# EAGLE design DoorALIM (EAGLE 7.6.0)
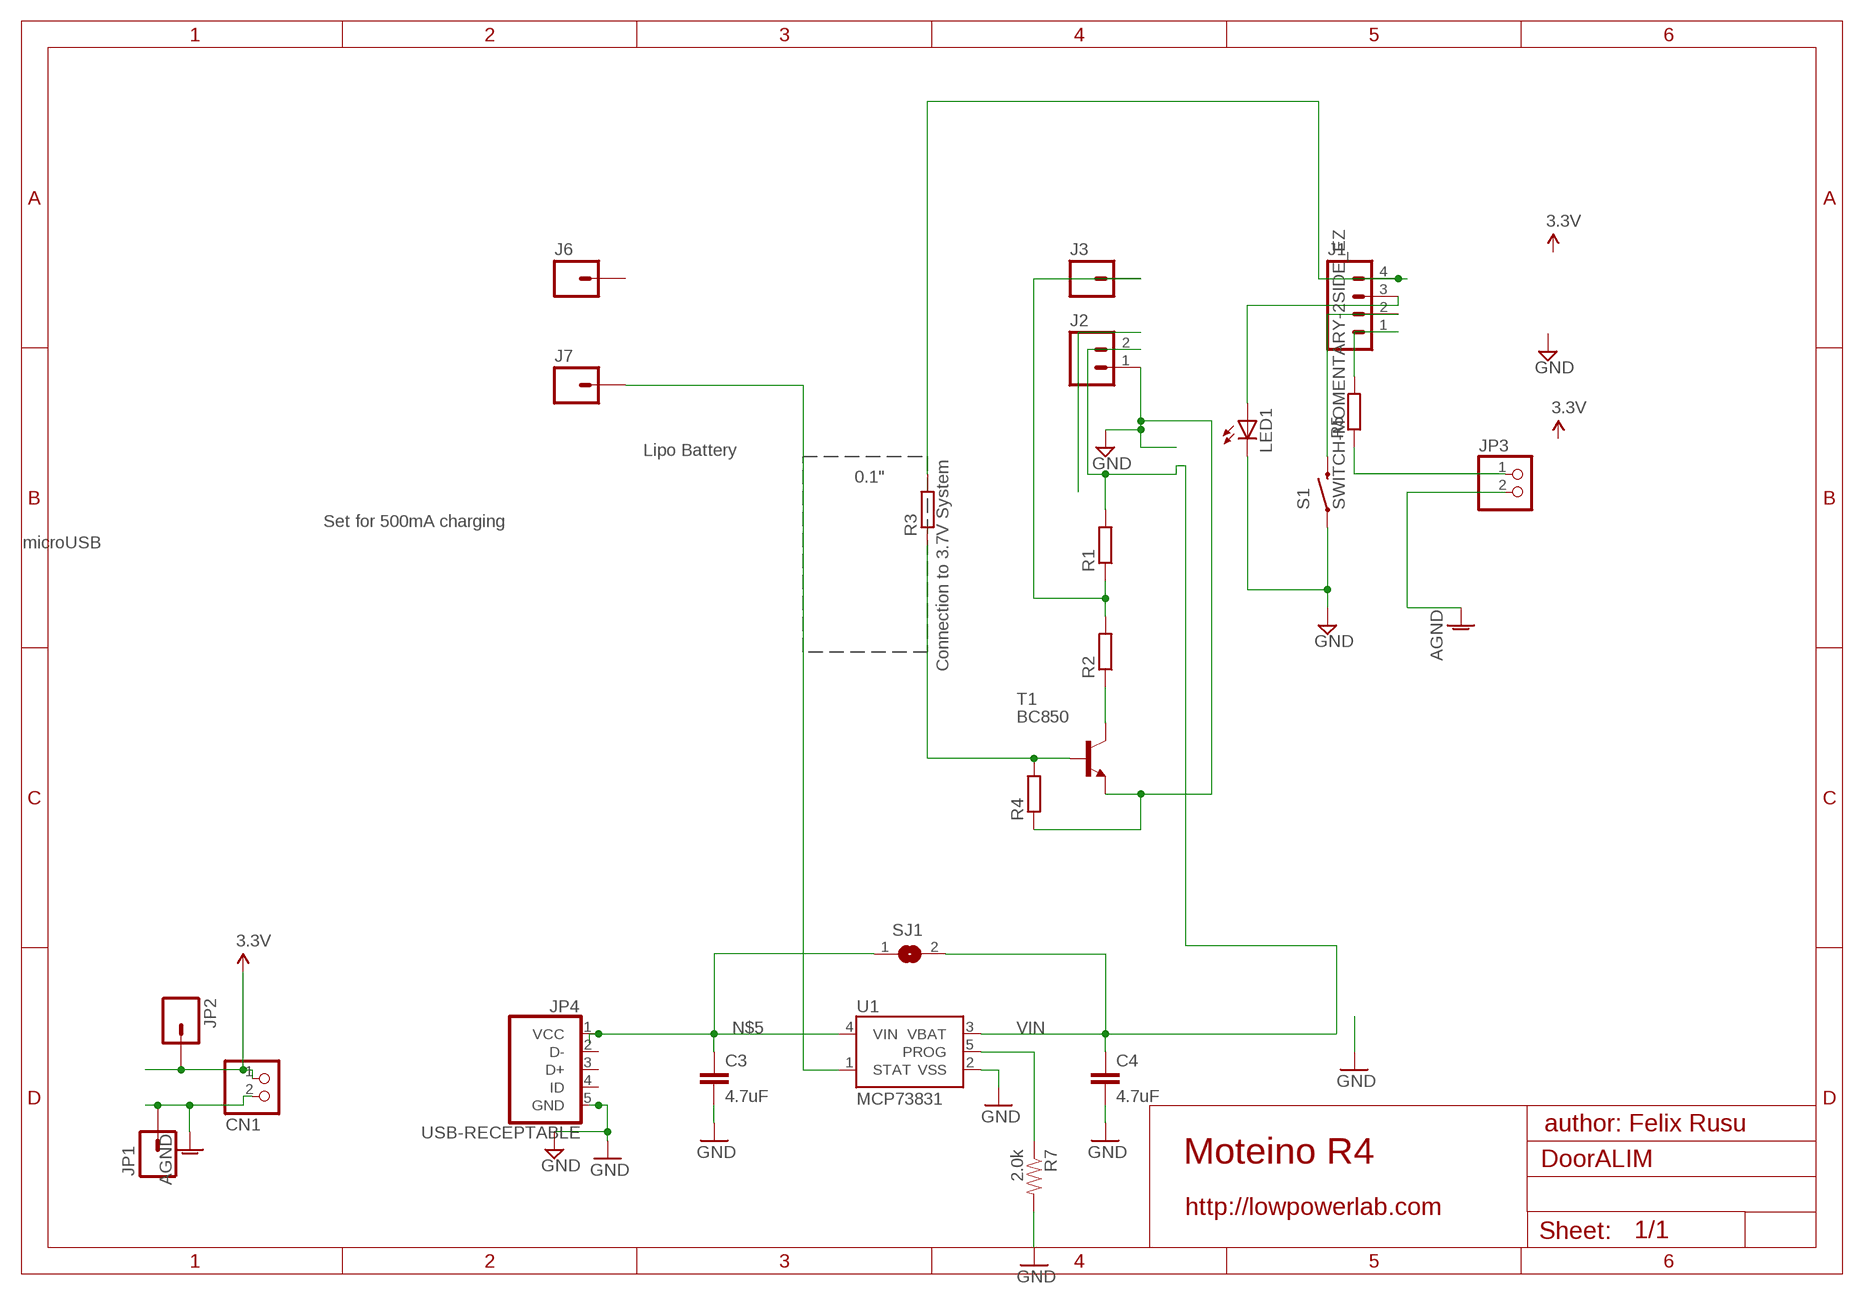
[diagram p0: schematic, sheet 1]

## Parts
C3  4.7uF  4.7UF-6.3V-10%(0603)0603  [0603-CAP]
C4  4.7uF  4.7UF-6.3V-10%(0603)0603  [0603-CAP]
CN1  JST_2PIN-SMT  [JST-PH-2-SMT]
J1  M04PTH  [1X04]
J2  M02PTH  [1X02]
J3  M01PTH  [1X01]
J6  M01PTH  [1X01]
J7  M01PTH  [1X01]
JP1  M01PTH  [1X01]
JP2  M01PTH  [1X01]
JP3  PINHD-1X2  [1X02]
JP4  USB-RECEPTABLE  [FCI-10103594-0001LF]
LED1  LED3MM  [LED3MM]
R1  R-EU_0204/7  [0204/7]
R2  R-EU_0204/7  [0204/7]
R3  R-EU_M1206  [M1206]
R4  R-EU_M1206  [M1206]
R5  R-EU_0204/7  [0204/7]
R7  2.0k  2.0KOHM1/10W5%(0603)  [0603-RES]
S1  SWITCH-MOMENTARY-2SIDE_EZ  [TACTILE-PTH-SIDEEZ]
SJ1  SJ  [SJ]
T1  BC850  [SOT23]
U1  MCP73831  [SOT23-5]

## Nets
AGND [power]: CN1.2 JP1.1 JP3.2
GND [power]: C3.2 C4.2 J2.1 JP4.5(GND) LED1.K(C) R4.1 R7.2 S1.1 T1.2(E) U1.2(VSS)
N$1: J1.2 S1.2
N$2: JP3.1 R5.1
N$3: J1.3 LED1.A
N$5: C3.1 JP4.1(VCC) SJ1.1 U1.4(VIN)
N$6: J3.1 R1.1 R2.2
N$7: R2.1 T1.3(C)
N$8: R3.1 R4.2 T1.1(B)
N$9: J1.4 R3.2
N$10: J1.1 R5.2
N$11: J7.1 U1.1(STAT)
PROG: R7.1 U1.5(PROG)
VCC: CN1.1 JP2.1 ; supply symbol labelled 3.3V
VIN: C4.1 J2.2 R1.2 SJ1.2 U1.3(VBAT)
Unconnected: J6.1 JP4.2(D-) JP4.3(D+) JP4.4(ID)

## Notes on the sheet
- Lipo Battery
- 0.1"
- Set for 500mA charging
- microUSB
- Connection to 3.7V System
- author: Felix Rusu
- Moteino R4
- http://lowpowerlab.com

## Library data of the parts
C3 C4 = SparkFun-Capacitors:4.7UF-6.3V-10%(0603): CAP-08280; PROD_ID: CAP-08280
CN1 = adafruit:JST_2PIN: JST 2-Pin Connectors of various flavors SMT-RA (S2B-PH-SM4) 4UConnector #17311 SMT (B2B-PH-SM4) THM-RA (S2B-PH) THM (B2B-PH)
J1 = SparkFun-Connectors:M04: Header 4 Standard 4-pin 0.1" header. Use with straight break away headers (SKU : PRT-00116), right angle break away headers (PRT-00553), swiss pins (PRT-00743), machine pins (PRT-00117), and female headers (PRT-00115). Molex polarized connector foot print use with SKU : PRT-08231 with associated crimp pins and housings. 1MM SMD Version SKU: PRT-10208; PROD_ID: CONN-09696
J2 = SparkFun-Connectors:M02: Standard 2-pin 0.1" header. Use with - straight break away headers ( PRT-00116) - right angle break away headers (PRT-00553) - swiss pins (PRT-00743) - machine pins (PRT-00117) - female headers (PRT-00115) Molex polarized connector foot print use with: PRT-08233 with associated crimp pins and housings. 2.54_SCREWTERM for use with PRT-10571. 3.5mm Screw Terminal footprints for PRT-08084 5mm Screw Terminal footprints for use with PRT-08432
J3 J6 J7 JP1 JP2 = SparkFun-Connectors:M01: Header 1 Standard 1-pin 0.1" header. Use with straight break away headers (SKU : PRT-00116), right angle break away headers (PRT-00553), swiss pins (PRT-00743), machine pins (PRT-00117), and female headers (PRT-00115). SMTSO-256-ET is a "flush mount" nut for a 4-40 screw. The older package used to be too tight, and did not allow it to sit properly thru the drill hit. The latest (0.165DIA) fits nice and snug.
JP3 = pinhead:PINHD-1X2: PIN HEADER
JP4 = daspilker:USB-RECEPTABLE: USB Receptable
LED1 = led:LED: LED OSRAM: - CHIPLED LG R971, LG N971, LY N971, LG Q971, LY Q971, LO R971, LY R971 LH N974, LH R974 LS Q976, LO Q976, LY Q976 LO Q996 - Hyper CHIPLED LW Q18S LB Q993, LB Q99A, LB R99A - SideLED LS A670, LO A670, LY A670, LG A670, LP A670 LB A673, LV A673, LT A673, LW A673 LH A674 LY A675 LS A676, LA A676, LO A676, LY A676, LW A676 LS A679, LY A679, LG A679 - Hyper Micro SIDELED® LS Y876, LA Y876, LO Y876, LY Y876 LT Y87S - SmartLED LW L88C, LW L88S LB L89C, LB L89S, LG L890 LS L89K, LO L89K, LY L89K LS L896, LA L896, LO L896, LY L896 - TOPLED LS T670, LO T670, LY T670, LG T670, LP T670 LSG T670, LSP T670, LSY T670, LOP T670, LYG T670 LG T671, LOG T671, LSG T671 LB T673, LV T673, LT T673, LW T673 LH T674 LS T676, LA T676, LO T676, LY T676, LB T676, LH T676, LSB T676, LW T676 LB T67C, LV T67C, LT T67C, LS T67K, LO T67K, LY T67K, LW E67C LS E67B, LA E67B, LO E67B, LY E67B, LB E67C, LV E67C, LT E67C LW T67C LS T679, LY T679, LG T679 LS T770, LO T770, LY T770, LG T770, LP T770 LB T773, LV T773, LT T773, LW T773 LH T774 LS E675, LA E675, LY E675, LS T675 LS T776, LA T776, LO T776, LY T776, LB T776 LHGB T686 LT T68C, LB T68C - Hyper Mini TOPLED® LB M676 - Mini TOPLED Santana® LG M470 LS M47K, LO M47K, LY M47K Source: http://www.osram.convergy.de LUXEON: - LUMILED® LXK2-PW12-R00, LXK2-PW12-S00, LXK2-PW14-U00, LXK2-PW14-V00 LXK2-PM12-R00, LXK2-PM12-S00, LXK2-PM14-U00 LXK2-PE12-Q00, LXK2-PE12-R00, LXK2-PE12-S00, LXK2-PE14-T00, LXK2-PE14-U00 LXK2-PB12-K00, LXK2-PB12-L00, LXK2-PB12-M00, LXK2-PB14-N00, LXK2-PB14-P00, LXK2-PB14-Q00 LXK2-PR12-L00, LXK2-PR12-M00, LXK2-PR14-Q00, LXK2-PR14-R00 LXK2-PD12-Q00, LXK2-PD12-R00, LXK2-PD12-S00 LXK2-PH12-R00, LXK2-PH12-S00 LXK2-PL12-P00, LXK2-PL12-Q00, LXK2-PL12-R00 Source: www.luxeon.com KINGBRIGHT: KA-3528ASYC Source: www.kingbright.com
R1-R5 = rcl:R-EU_: RESISTOR, European symbol
R7 = SparkFun-Resistors:2.0KOHM1/10W5%(0603): RES-08296; PROD_ID: RES-08296
S1 = SparkFun-Electromechanical:SWITCH-MOMENTARY-2: Various NO switches- pushbuttons, reed, etc
SJ1 = jumper:SJ: SMD solder JUMPER
T1 = transistor:BC850: NPN TRANSISTOR
U1 = SparkFun-PowerIC:MCP73831: Miniature single cell, fully integrated Li-Ion, Li-polymer charge management controller http://ww1.microchip.com/downloads/en/DeviceDoc/21984a.pdf IC-09995; PROD_ID: IC-09995

## Net classes
1 power: width 0.381 mm, clearance 0.254 mm

## Board
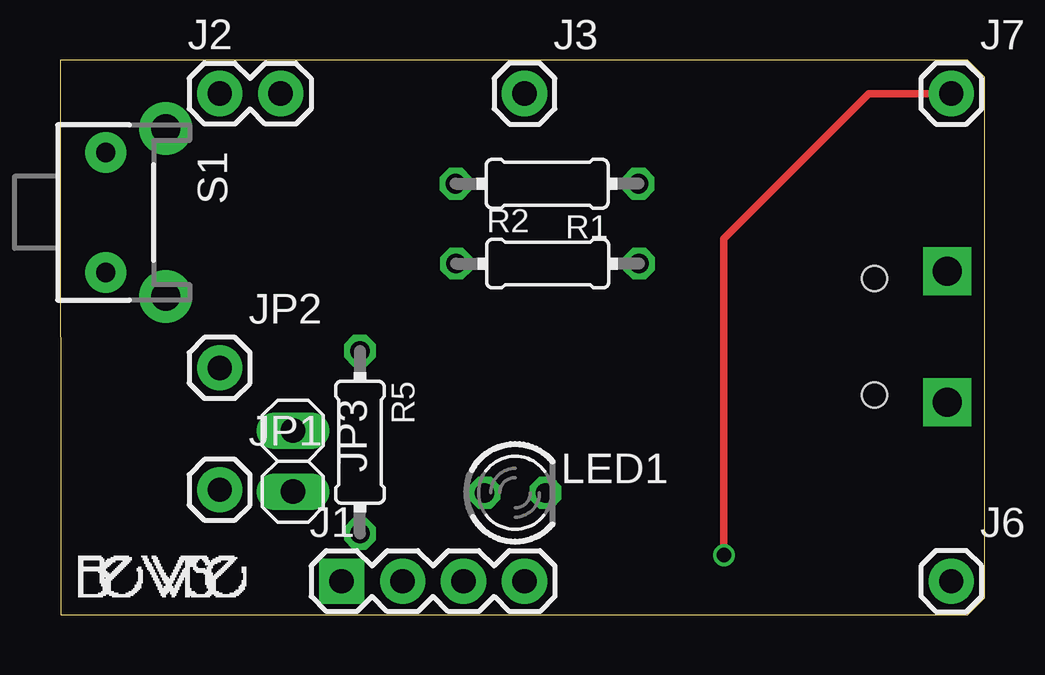
[diagram p1: board, top side]
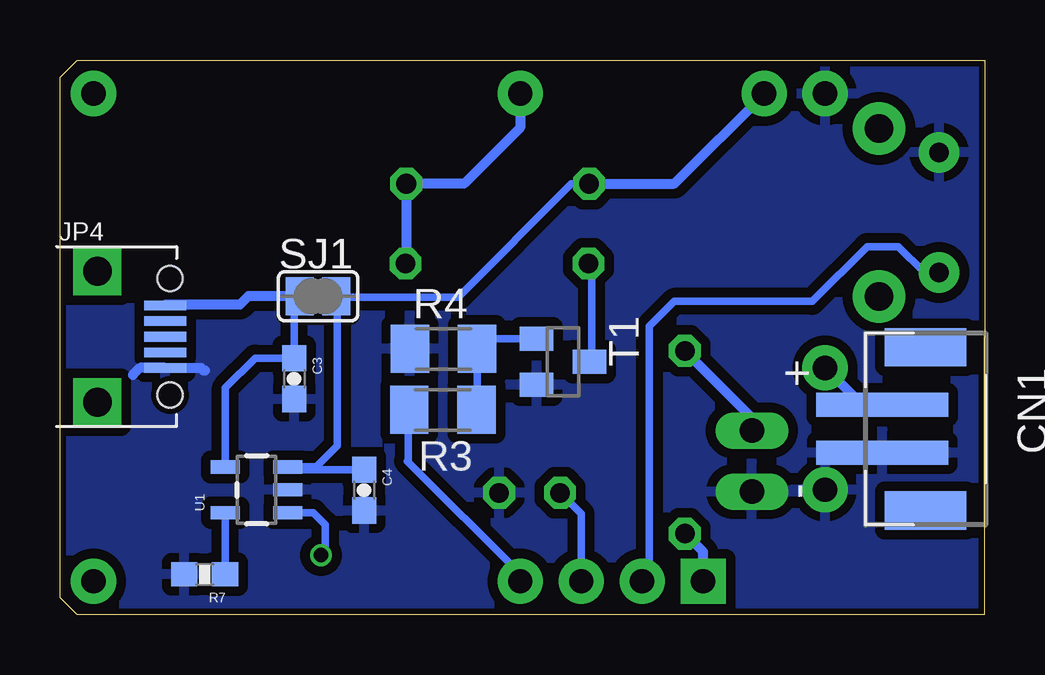
[diagram p2: board, bottom side, seen from below]

Size 38.53 x 23.11 mm. Coordinates in mm from the lower left corner, seen from the top.
Outline: 0.03,0 37.82,0 38.53,0.71 38.53,22.4 37.82,23.11 0,23.11 0.03,0
Copper layers (1*16): Top 0.035mm / dielectric 1.5mm / Bottom 0.035mm
Design rules "ITEADstudio_DRC *": minimum track width 6mil, minimum drill 12mil, track to track 16mil, track to pad 12mil, pad to pad 6mil, via to via 6mil, smd to smd 0mil, copper to edge 10mil, drill to drill 10mil, minimum pad ring 10mil, minimum via ring 6mil, stop-mask expansion 2mil, vias tented up to drill 100mil, thermal gap 15mil

### Footprints (pad centres in the part's own frame; a part is rotated, then mirrored left to right if it is on the bottom)
0603-CAP = smd 1.1 x 1: 1 -0.85,0; 2 0.85,0
JST-PH-2-SMT = smd 1 x 5.5: 1 -1,-1.8; 2 1,-1.8 | smd 1.6 x 3.4: NC1 -3.4,0; NC2 3.4,0
1X04 = drill 1.016 pad 1.88 square: 1 0,0 | drill 1.016 pad 1.88: 2 2.54,0; 3 5.08,0; 4 7.62,0
1X02 = drill 1.016 pad 1.88: 1 0,0; 2 2.54,0
1X01 = drill 1.016 pad 1.88: 1 0,0
1X02' = drill 1.016 long: 1 -1.27,0; 2 1.27,0
FCI-10103594-0001LF = smd 0.4 x 1.75: 1 -1.3,4.525; 2 -0.65,4.525; 3 0,4.525; 4 0.65,4.525; 5 1.3,4.525 | drill 1.2 pad 2 square: P$3 -2.725,1.7; P$4 2.725,1.7 | hole 1.05: -2.425,4.73; 2.425,4.73
LED3MM = drill 0.813 octagon: A -1.27,0; K 1.27,0
0204/7 = drill 0.813 octagon: 1 -3.81,0; 2 3.81,0
M1206 = smd 1.6 x 2: 1 -1.4,0; 2 1.4,0
0603-RES = smd 1.1 x 1: 1 -0.85,0; 2 0.85,0
TACTILE-PTH-SIDEEZ = drill 0.8 pad 1.7: 1 -2.5,0; 2 2.5,0 | drill 1.2 pad 2.2: ANCHOR1 -3.5,2.5; ANCHOR2 3.5,2.5
SJ = smd 1.168 x 1.6: 1 -0.762,0; 2 0.762,0
SOT23 = smd 1 x 1.4: 1 -0.95,-1.1; 2 0.95,-1.1; 3 0,1.1
SOT23-5 = smd 0.55 x 1.2: 1 -0.95,-1.3; 2 0,-1.3; 3 0.95,-1.3; 4 0.95,1.3; 5 -0.95,1.3

### Placement (x,y rotation side)
C3  28.77,9.84 270 bottom
C4  25.86,5.19 270 bottom
CN1  2.46,7.75 270 bottom
J1  11.73,1.4 0 top
J2  6.65,21.72 0 top
J3  19.35,21.72 0 top
J6  37.13,1.4 0 top
J7  37.13,21.72 0 top
JP1  6.65,5.21 0 top
JP2  6.65,10.29 0 top
JP3  [1X02']  9.7,6.4 270 top
JP4  38.67,11.58 270 bottom
LED1  18.96,5.08 0 top
R1  20.29,17.96 180 top
R2  20.32,14.63 0 top
R3  22.58,8.53 180 bottom
R4  22.56,11.07 0 bottom
R5  12.5,7.19 270 top
R7  32.51,1.68 180 bottom
S1  1.91,16.76 270 top
SJ1  27.78,13.27 0 bottom
T1  17.58,10.54 270 bottom
U1  30.34,5.2 90 bottom

### Tracks (layer width: path | path; a pad name or v marks a point on that pad's centre or on a via)
AGND
  pour Bottom: 0.15,22.94 38.35,22.91 38.3,0.08 0.15,0.18
GND
  Bottom 0.406: 35.49,9.99 35.2,10.29 JP4.5 32.66,10.29 32.56,10.18 32.5,10.18
  pour Bottom: 0.15,22.91 38.3,22.86 38.3,0.15 0.15,0.2
N$1
  Bottom 0.305: S1.2 2.53,14.26 3.61,15.34 4.9,15.34 7.19,13.06 12.93,13.06 13.97,12.01 13.97,1.7 J1.2
N$2
  Bottom 0.406: JP3.1 9.7,8.2 R5.1
N$3
  Bottom 0.305: J1.3 16.81,4.2 LED1.A
N$5
  Bottom 0.305: U1.4 31.64,9.45 30.4,10.69 C3.1 28.77,13.04 SJ1.1
  Bottom 0.406: SJ1.1 30.69,13.27 31.03,12.92 34.11,12.92 JP4.1
N$6
  Bottom 0.406: J3.1 19.35,20.3 21.69,17.96 R1.1 24.1,15.52 R2.2
N$7
  Bottom 0.305: T1.3 16.38,10.63 16.38,14.5 R2.1
N$8
  Bottom 0.305: T1.1 20.74,11.49 R4.2 21.16,8.56 R3.1
N$9
  Bottom 0.305: J1.4 19.35,1.7 24.05,6.4 24.03,6.43 24.03,8.49 R3.2
N$10
  Bottom 0.406: J1.1 11.73,2.62 R5.2
N$11  (via drill 0.6)
  Top 0.305: v27.66,2.48 27.66,15.66 33.71,21.7 37.12,21.7 J7.1
  Bottom 0.305: U1.1 27.97,4.25 27.47,3.75 27.47,2.67 v27.66,2.48
PROG
  Bottom 0.305: R7.1 31.66,4.24 U1.5
VCC
  Bottom 0.406: CN1.1 5.11,8.75 JP2.1
VIN
  Bottom 0.305: R1.2 17.22,17.96 21.95,13.23 26.98,13.23 | 26.98,13.23 SJ1.2 | 26.98,13.23 26.98,7.05 27.85,6.17 29.02,6.17 U1.3 28.93,6.04 C4.1
  Bottom 0.406: J2.2 9.19,21.69 12.93,17.96 R1.2

### Text on the board
121bmp: VIN | A7 | GND | VIN | 3 | 4 | 5 | 6 | GND | ~ | ~ | ~